# EAGLE design matrixzilla (EAGLE 5.11)
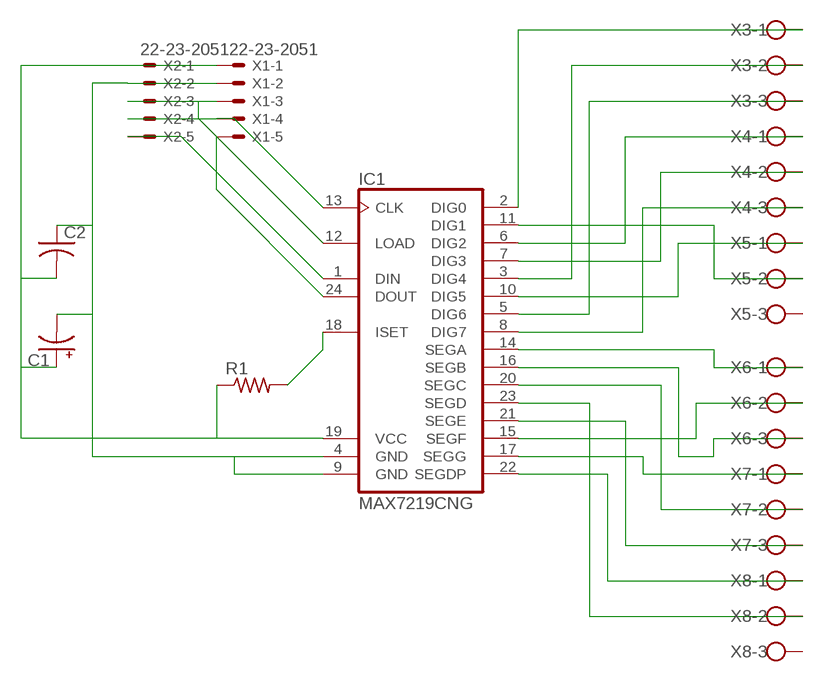
[diagram p0: schematic, sheet 1]

## Parts
C1  CPOL-USE2.5-6  [E2,5-6]
C2  C-US075-032X103  [C075-032X103]
IC1  MAX7219CNG  [DIL24-3]
R1  R-US_0207/12  [0207/12]
X1  22-23-2051  [22-23-2051]
X2  22-23-2051  [22-23-2051]
X3  W237-103  [W237-103]
X4  W237-103  [W237-103]
X5  W237-103  [W237-103]
X6  W237-103  [W237-103]
X7  W237-103  [W237-103]
X8  W237-103  [W237-103]

## Nets
N$1: IC1.2(DIG0) X3.1
N$2: IC1.3(DIG4) X3.2
N$3: IC1.5(DIG6) X3.3
N$4: IC1.6(DIG2) X4.1
N$5: IC1.7(DIG3) X4.2
N$6: IC1.8(DIG7) X4.3
N$7: IC1.10(DIG5) X5.1
N$8: IC1.11(DIG1) X5.2
N$9: IC1.14(SEGA) X6.1
N$10: IC1.15(SEGF) X6.2
N$11: IC1.16(SEGB) X6.3
N$12: IC1.17(SEGG) X7.1
N$13: IC1.20(SEGC) X7.2
N$14: IC1.21(SEGE) X7.3
N$15: IC1.22(SEGDP) X8.1
N$16: IC1.23(SEGD) X8.2
N$17: C1.- C2.1 IC1.4(GND) IC1.9(GND) X1.2 X2.2
N$18: C1.+ C2.2 IC1.19(VCC) R1.1 X1.1 X2.1
N$19: IC1.18(ISET) R1.2
N$20: IC1.24(DOUT) X1.5
N$21: IC1.1(DIN) X2.5
N$22: IC1.13(CLK) X1.4 X2.4
N$23: IC1.12(LOAD) X1.3 X2.3
Unconnected: X5.3 X8.3

## Library data of the parts
C1 = rcl:CPOL-US: POLARIZED CAPACITOR, American symbol
C2 = resistor:C-US: CAPACITOR, American symbol
IC1 = maxim:MAX7219CNG: LED DISPLAY DRIVER; MF: MAXIM; MPN: MAX7219CNG; OC_FARNELL: 1523914; OC_NEWARK: 34C4018
R1 = resistor:R-US_: RESISTOR, American symbol
X1 X2 = con-molex:22-23-2051: .100" (2.54mm) Center Header - 5 Pin; MF: MOLEX; MPN: 22-23-2051; OC_FARNELL: 1462952; OC_NEWARK: 38C9178
X3-X8 = con-wago-500:W237-103: WAGO SCREW CLAMP; MPN: 237-103; OC_FARNELL: unknown; OC_NEWARK: 18M7116

## Board
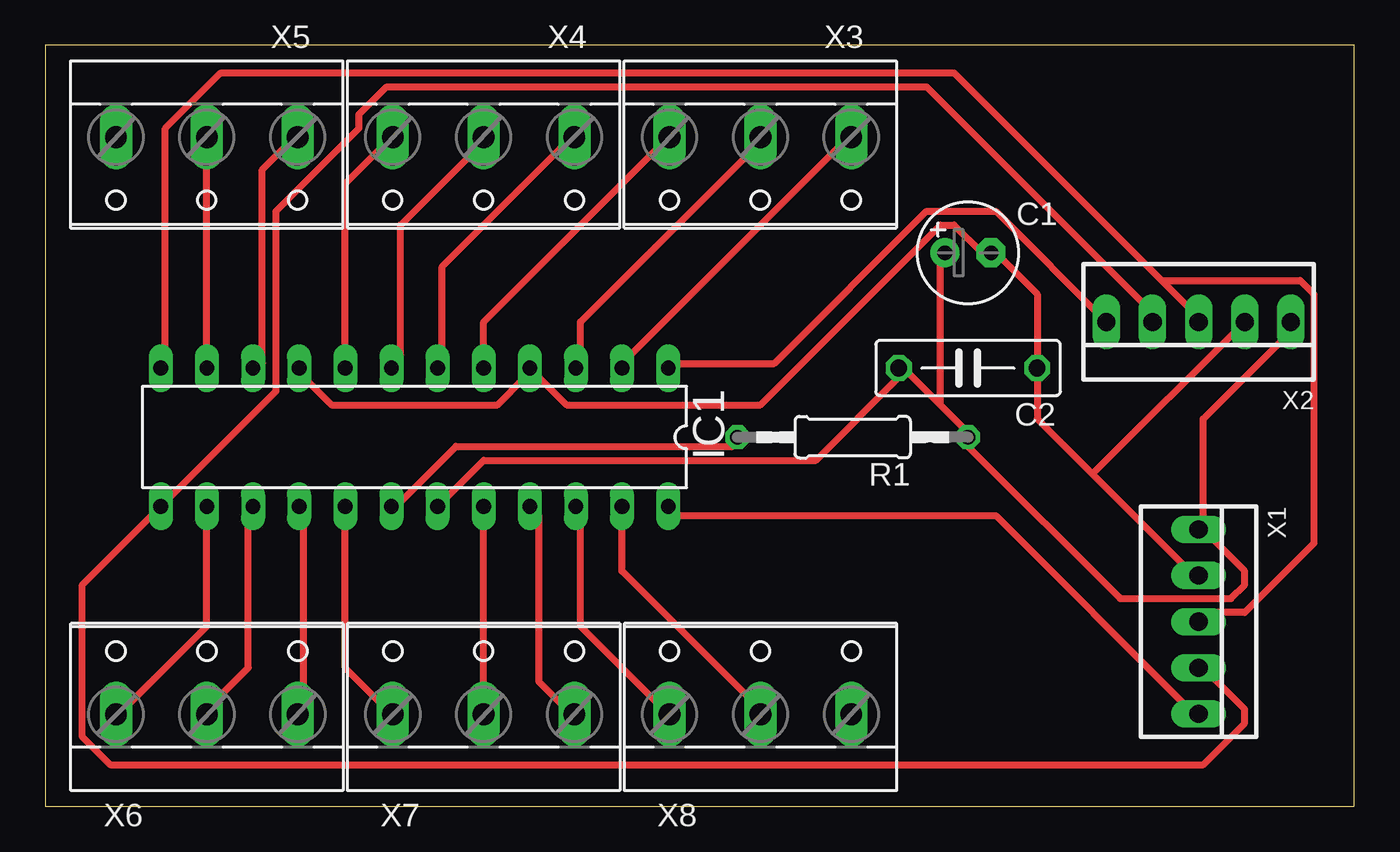
[diagram p1: board, top side]

Size 72.06 x 41.9 mm. Coordinates in mm from the lower left corner, seen from the top.
Outline: 0,0 72.06,0 72.06,41.9 0,41.9 0,0
Copper layers (1*16): Top 0.035mm / dielectric 1.5mm / Bottom 0.035mm
Design rules "default *": minimum track width 15mil, minimum drill 24mil, track to track 8mil, track to pad 8mil, pad to pad 8mil, via to via 8mil, smd to smd 8mil, copper to edge 40mil, drill to drill 8mil, minimum pad ring 10mil, minimum via ring 8mil, stop-mask expansion 4mil, vias tented up to drill 0mil, thermal gap 10mil

### Footprints (pad centres in the part's own frame; a part is rotated, then mirrored left to right if it is on the bottom)
E2,5-6 = drill 0.813 pad 1.6 round: + -1.27,0 | drill 0.813 pad 1.6 octagon: - 1.27,0
C075-032X103 = drill 0.914 octagon: 1 -3.81,0; 2 3.81,0
DIL24-3 = drill 0.813 long: 1 -13.97,-3.81; 2 -11.43,-3.81; 3 -8.89,-3.81; 4 -6.35,-3.81; 5 -3.81,-3.81; 6 -1.27,-3.81; 7 1.27,-3.81; 8 3.81,-3.81; 9 6.35,-3.81; 10 8.89,-3.81; 11 11.43,-3.81; 12 13.97,-3.81; 13 13.97,3.81; 14 11.43,3.81; 15 8.89,3.81; 16 6.35,3.81; 17 3.81,3.81; 18 1.27,3.81; 19 -1.27,3.81; 20 -3.81,3.81; 21 -6.35,3.81; 22 -8.89,3.81; 23 -11.43,3.81; 24 -13.97,3.81
0207/12 = drill 0.813 octagon: 1 -6.35,0; 2 6.35,0
22-23-2051 = drill 1 long: 1 -5.08,0; 2 -2.54,0; 3 0,0; 4 2.54,0; 5 5.08,0
W237-103 = drill 1.194 long: 1 -5,-1.29; 2 0,-1.29; 3 5,-1.29

### Placement (x,y rotation side)
C1  50.8,30.48 0 top
C2  50.8,24.13 180 top
IC1  20.32,20.32 180 top
R1  44.45,20.32 180 top
X1  63.5,10.16 270 top
X2  63.5,26.67 180 top
X3  39.37,35.56 180 top
X4  24.13,35.56 180 top
X5  8.89,35.56 180 top
X6  8.89,6.35 0 top
X7  24.13,6.35 0 top
X8  39.37,6.35 0 top

### Tracks (layer width: path | path; a pad name or v marks a point on that pad's centre or on a via)
N$1
  Top 0.381: IC1.2 31.75,24.38 43.94,36.58 X3.1
N$2
  Top 0.381: IC1.3 29.46,24.38 29.46,26.67 39.37,36.58 X3.2
N$3
  Top 0.381: IC1.5 24.13,26.67 34.04,36.58 X3.3
N$4
  Top 0.381: IC1.6 21.84,24.38 21.84,29.72 28.7,36.58 X4.1
N$5
  Top 0.381: IC1.7 19.56,24.38 19.56,32 24.13,36.58 X4.2
N$6
  Top 0.381: IC1.8 16.51,34.29 18.8,36.58 X4.3
N$7
  Top 0.381: IC1.10 11.94,24.38 11.94,35.05 13.46,36.58 X5.1
N$8
  Top 0.381: IC1.11 X5.2
N$9
  Top 0.381: IC1.14 8.89,9.91 4.32,5.33 X6.1
N$10
  Top 0.381: IC1.15 11.18,16 11.18,7.62 8.89,5.33 X6.2
N$11
  Top 0.381: IC1.16 14.22,16 14.22,5.33 X6.3
N$12
  Top 0.381: IC1.17 16.51,7.62 18.8,5.33 X7.1
N$13
  Top 0.381: X7.2 IC1.20
N$14
  Top 0.381: IC1.21 27.18,16 27.18,6.86 28.7,5.33 X7.3
N$15
  Top 0.381: IC1.22 29.46,16 29.46,9.91 34.04,5.33 X8.1
N$16
  Top 0.381: IC1.23 31.75,12.95 39.37,5.33 X8.2
N$17
  Top 0.381: IC1.9 14.22,23.62 15.75,22.1 24.89,22.1 26.42,23.62 IC1.4 28.7,22.1 39.37,22.1 49.28,32 50.04,32 51.56,30.48 C1.- 52.32,30.48 54.61,28.19 C2.1 54.61,21.34 57.66,18.29 | 57.66,18.29 62.99,12.95 X1.2 | 57.66,18.29 X2.2
N$18
  Top 0.381: 63.75,15.24 63.75,21.34 69.09,26.67 X2.1 | IC1.19 24.13,19.05 42.42,19.05 46.99,23.62 C2.2 46.99,24.38 49.28,22.1 | 49.28,22.1 50.8,20.57 R1.1 50.8,19.81 59.18,11.43 65.28,11.43 66.04,12.19 66.04,12.95 63.75,15.24 | 49.28,22.1 49.28,30.48 C1.+ | 63.75,15.24 X1.1
N$19
  Top 0.381: IC1.18 19.56,16.76 22.61,19.81 37.85,19.81 R1.2
N$20
  Top 0.381: IC1.24 34.8,16 52.32,16 62.99,5.33 X1.5
N$21
  Top 0.381: X2.5 52.32,32.77 48.51,32.77 40.13,24.38 34.8,24.38 IC1.1
N$22
  Top 0.381: X2.4 61.47,26.67 48.51,39.62 18.8,39.62 17.27,38.1 17.27,37.34 12.7,32.77 12.7,22.86 IC1.13 2.03,12.19 2.03,3.81 3.56,2.29 63.75,2.29 66.04,4.57 66.04,5.33 63.75,7.62 X1.4
N$23
  Top 0.381: 61.47,28.96 63.75,26.67 X2.3 | 61.47,28.96 50.04,40.39 9.65,40.39 6.6,37.34 6.6,24.38 IC1.12 | 61.47,28.96 69.09,28.96 69.85,28.19 69.85,14.48 66.04,10.67 63.75,10.67 X1.3